# EAGLE design ASP1 K2-234004U (EAGLE 9.6.2)
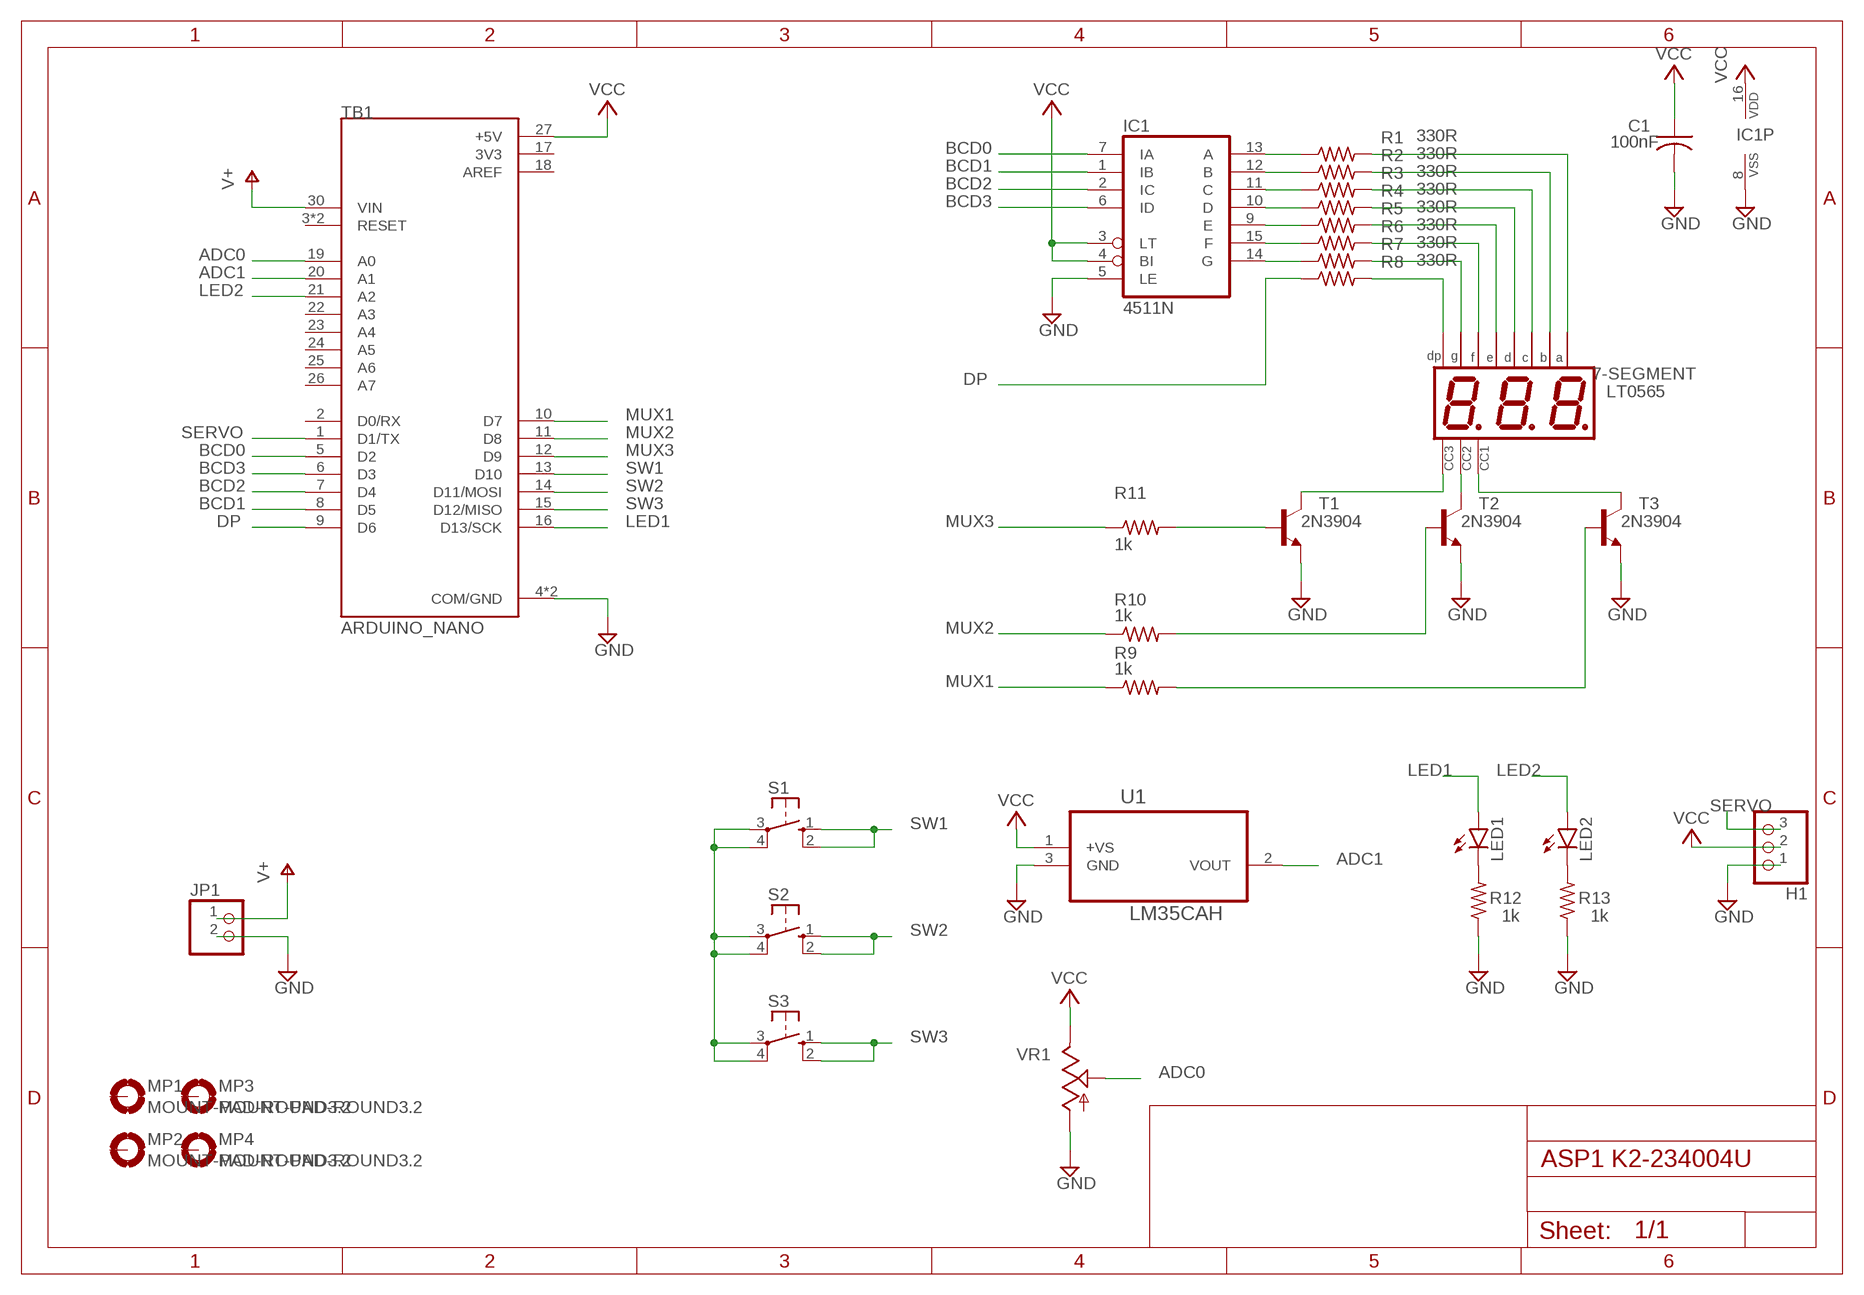
[diagram p0: schematic, sheet 1]

## Parts
7-SEGMENT  LT0565  [BX56/BX55]
C1  100nF  C-US050-024X044  [C050-024X044]
H1  PINHD-1X3  [1X03]
IC1  4511N  [DIL16]
JP1  PINHD-1X2  [1X02]
LED1  LED3MM  [LED3MM]
LED2  LED3MM  [LED3MM]
MP1  MOUNT-PAD-ROUND3.2  [3,2-PAD]
MP2  MOUNT-PAD-ROUND3.2  [3,2-PAD]
MP3  MOUNT-PAD-ROUND3.2  [3,2-PAD]
MP4  MOUNT-PAD-ROUND3.2  [3,2-PAD]
R1  330R  R-US_0207/10  [0207/10]
R2  330R  R-US_0207/10  [0207/10]
R3  330R  R-US_0207/10  [0207/10]
R4  330R  R-US_0207/10  [0207/10]
R5  330R  R-US_0207/10  [0207/10]
R6  330R  R-US_0207/10  [0207/10]
R7  330R  R-US_0207/10  [0207/10]
R8  330R  R-US_0207/10  [0207/10]
R9  1k  R-US_0207/10  [0207/10]
R10  1k  R-US_0207/10  [0207/10]
R11  1k  R-US_0207/10  [0207/10]
R12  1k  R-US_0207/10  [0207/10]
R13  1k  R-US_0207/10  [0207/10]
S1  10-XX  [B3F-10XX]
S2  10-XX  [B3F-10XX]
S3  10-XX  [B3F-10XX]
T1  2N3904  [TO92]
T2  2N3904  [TO92]
T3  2N3904  [TO92]
TB1  ARDUINO_NANO  [SHIELD_ARDUINO_NANO]
U1  LM35CAH  [TO127P543X266-3P]
VR1  POTENTIOMETER_PT10  [PT-10]

## Nets
ADC0 [Signal]: TB1.19(A0) VR1.3(S)
ADC1 [Signal]: TB1.20(A1) U1.2(VOUT)
BCD0 [Signal]: IC1.7(IA) TB1.5(D2)
BCD1 [Signal]: IC1.1(IB) TB1.8(D5)
BCD2 [Signal]: IC1.2(IC) TB1.7(D4)
BCD3 [Signal]: IC1.6(ID) TB1.6(D3)
DP [Signal]: R8.1 TB1.9(D6)
GND [Power]: C1.2 H1.1 IC1.5(LE) IC1.8(VSS) JP1.2 R12.1 R13.1 T1.3(E) T2.3(E) T3.3(E) TB1.4(COM/GND) TB1.29(COM/GND) U1.3(GND) VR1.1(A)
LED1 [Signal]: LED1.A TB1.16(D13/SCK)
LED2 [Signal]: LED2.A TB1.21(A2)
MUX1 [Signal]: R9.1 TB1.10(D7)
MUX2 [Signal]: R10.1 TB1.11(D8)
MUX3 [Signal]: R11.1 TB1.12(D9)
N$1 [Signal]: S1.3(P) S1.4(P1) S2.3(P) S2.4(P1) S3.3(P) S3.4(P1)
N$2 [Signal]: LED2.K(C) R13.2
N$3 [Signal]: LED1.K(C) R12.2
N$4 [Signal]: IC1.13(A) R1.1
N$5 [Signal]: IC1.12(B) R2.1
N$6 [Signal]: IC1.11(C) R3.1
N$7 [Signal]: IC1.10(D) R4.1
N$8 [Signal]: IC1.9(E) R5.1
N$9 [Signal]: IC1.15(F) R6.1
N$10 [Signal]: IC1.14(G) R7.1
N$11 [Signal]: 7-SEGMENT.3(DP) R8.2
N$12 [Signal]: 7-SEGMENT.5(G) R7.2
N$13 [Signal]: 7-SEGMENT.10(F) R6.2
N$14 [Signal]: 7-SEGMENT.1(E) R5.2
N$15 [Signal]: 7-SEGMENT.2(D) R4.2
N$16 [Signal]: 7-SEGMENT.4(C) R3.2
N$17 [Signal]: 7-SEGMENT.11(A) R1.2
N$18 [Signal]: 7-SEGMENT.7(B) R2.2
N$19 [Signal]: 7-SEGMENT.9(CA) T2.1(C)
N$21 [Signal]: 7-SEGMENT.12(CA) T3.1(C)
N$22 [Signal]: 7-SEGMENT.8(CA) T1.1(C)
N$23 [Signal]: R10.2 T2.2(B)
N$24 [Signal]: R9.2 T3.2(B)
N$25 [Signal]: R11.2 T1.2(B)
SERVO [Signal]: H1.3 TB1.1(D1/TX)
SW1 [Signal]: S1.1(S) S1.2(S1) TB1.13(D10)
SW2 [Signal]: S2.1(S) S2.2(S1) TB1.14(D11/MOSI)
SW3 [Signal]: S3.1(S) S3.2(S1) TB1.15(D12/MISO)
V+ [Power]: JP1.1 TB1.30(VIN)
VCC [Power]: C1.1 H1.2 IC1.3(LT) IC1.4(BI) IC1.16(VDD) TB1.27(+5V) U1.1(+VS) VR1.2(E)
Unconnected: MP1.B3,2(MOUNT) MP2.B3,2(MOUNT) MP3.B3,2(MOUNT) MP4.B3,2(MOUNT) TB1.2(D0/RX) TB1.3(RESET) TB1.22(A3) TB1.23(A4) TB1.24(A5) TB1.25(A6) TB1.26(A7) TB1.28(RESET)

## Power pins joined to a net without a drawn wire
3V3: TB1.17(3V3)
AREF: TB1.18(AREF)

## Library data of the parts
7-SEGMENT = MCU Project - Copy:LT0565: 3-Digit Common Cathode LED Numeric Display
C1 = MCU Project - Copy:C-US
H1 = pinhead:PINHD-1X3: PIN HEADER
IC1 = MCU Project - Copy:4511: BCD to 7-segment LATCH/DECODER/DRIVER
JP1 = pinhead:PINHD-1X2: PIN HEADER
LED1 LED2 = MCU Project - Copy:LED3MM
MP1-MP4 = holes:MOUNT-PAD-ROUND: MOUNTING PAD, round
R1-R13 = MCU Project - Copy:R-US
S1-S3 = MCU Project - Copy:10-XX: OMRON SWITCH; MPN: B3F-1000; OC_FARNELL: 176432; OC_NEWARK: 36M3542
T1-T3 = MCU Project - Copy:2N3904: NPN TRANSISTOR
TB1 = MCU Project - Copy:ARDUINO_NANO: Arduino Nano, Through Hole Check availability <https://pricing.snapeda.com/parts/Arduino%20Nano/Arduino/view-part?ref=eda>; AVAILABILITY: Not in stock; CHECK_PRICES: https://www.snapeda.com/parts/Arduino%20Nano/Arduino/view-part/?ref=eda; DESCRIPTION: Small, complete, and breadboard-friendly board based on the ATmega328 (Arduino Nano 3.x); MF: Arduino; MP: Arduino Nano; PACKAGE: Non-Standard Arduino; PRICE: None; SNAPEDA_LINK: https://www.snapeda.com/parts/Arduino%20Nano/Arduino/view-part/?ref=snap
U1 = MCU Project - Copy:LM35CAH: IC, PRECISION TEMP SENSOR Check availability <https://pricing.snapeda.com/parts/LM35CAH/Texas%20Instruments/view-part?ref=eda>; AVAILABILITY: In Stock; CHECK_PRICES: https://www.snapeda.com/parts/LM35CAH/Texas+Instruments/view-part/?ref=eda; DESCRIPTION: 1C high voltage analog temperature sensor, 10 mV/C; MF: Texas Instruments; MP: LM35CAH; PACKAGE: TO-CAN-3 Texas Instruments; PRICE: None; SNAPEDA_LINK: https://www.snapeda.com/parts/LM35CAH/Texas+Instruments/view-part/?ref=snap
VR1 = MCU Project - Copy:POTENTIOMETER

## Net classes
1 Power: width 0.635 mm
2 Signal: width 0.406 mm

## Board
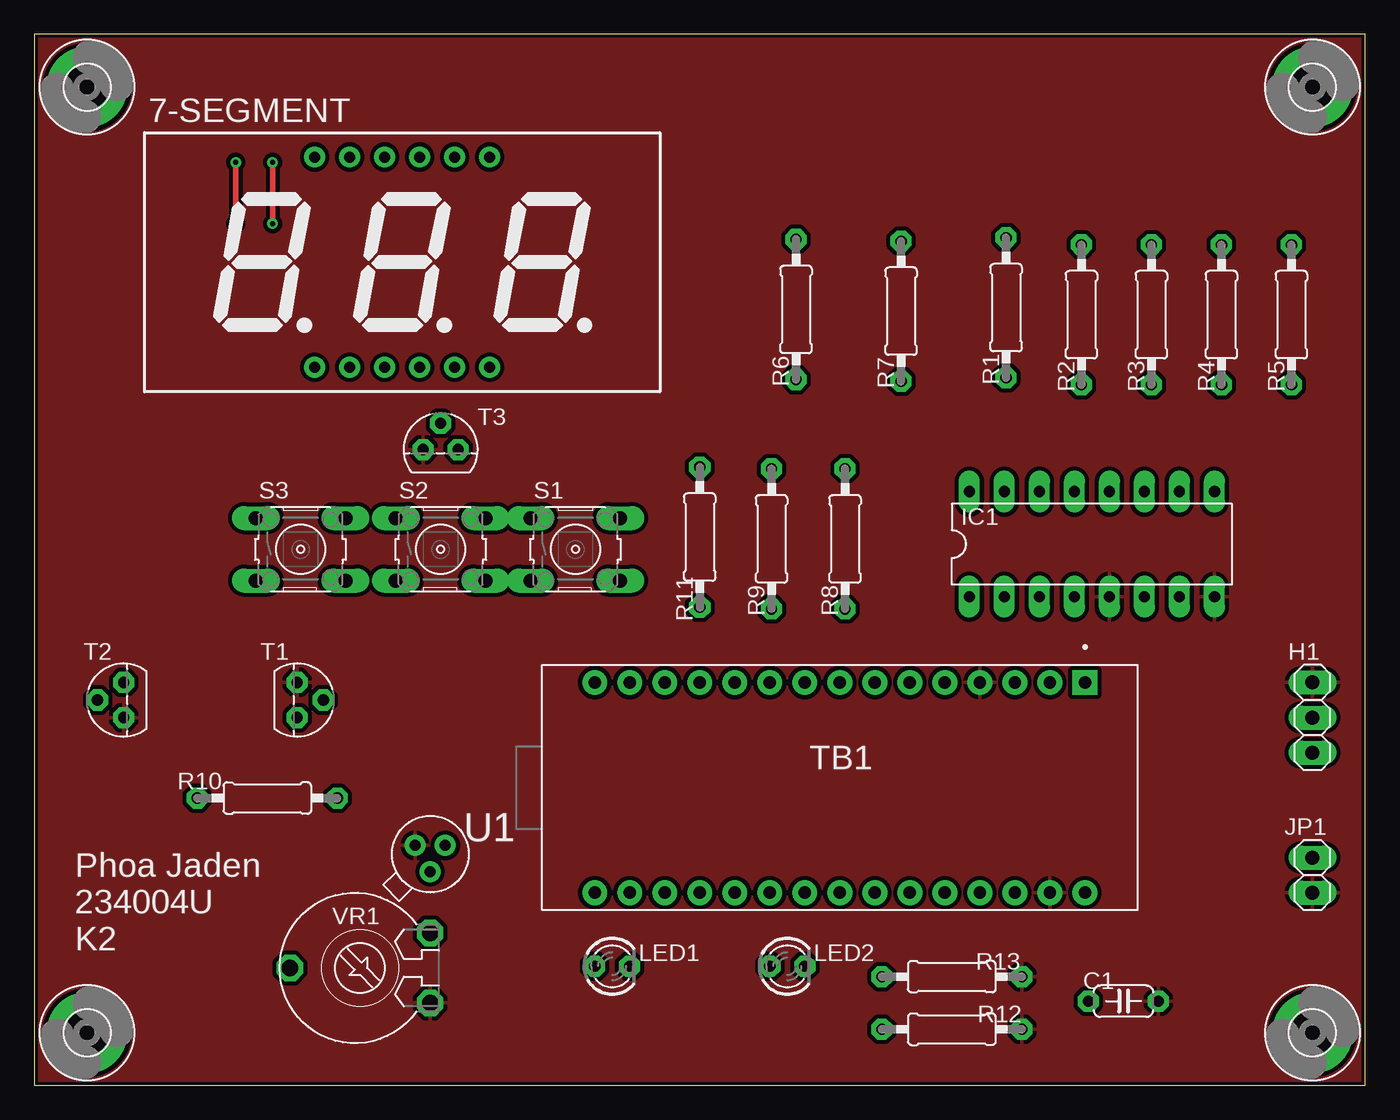
[diagram p1: board, top side]
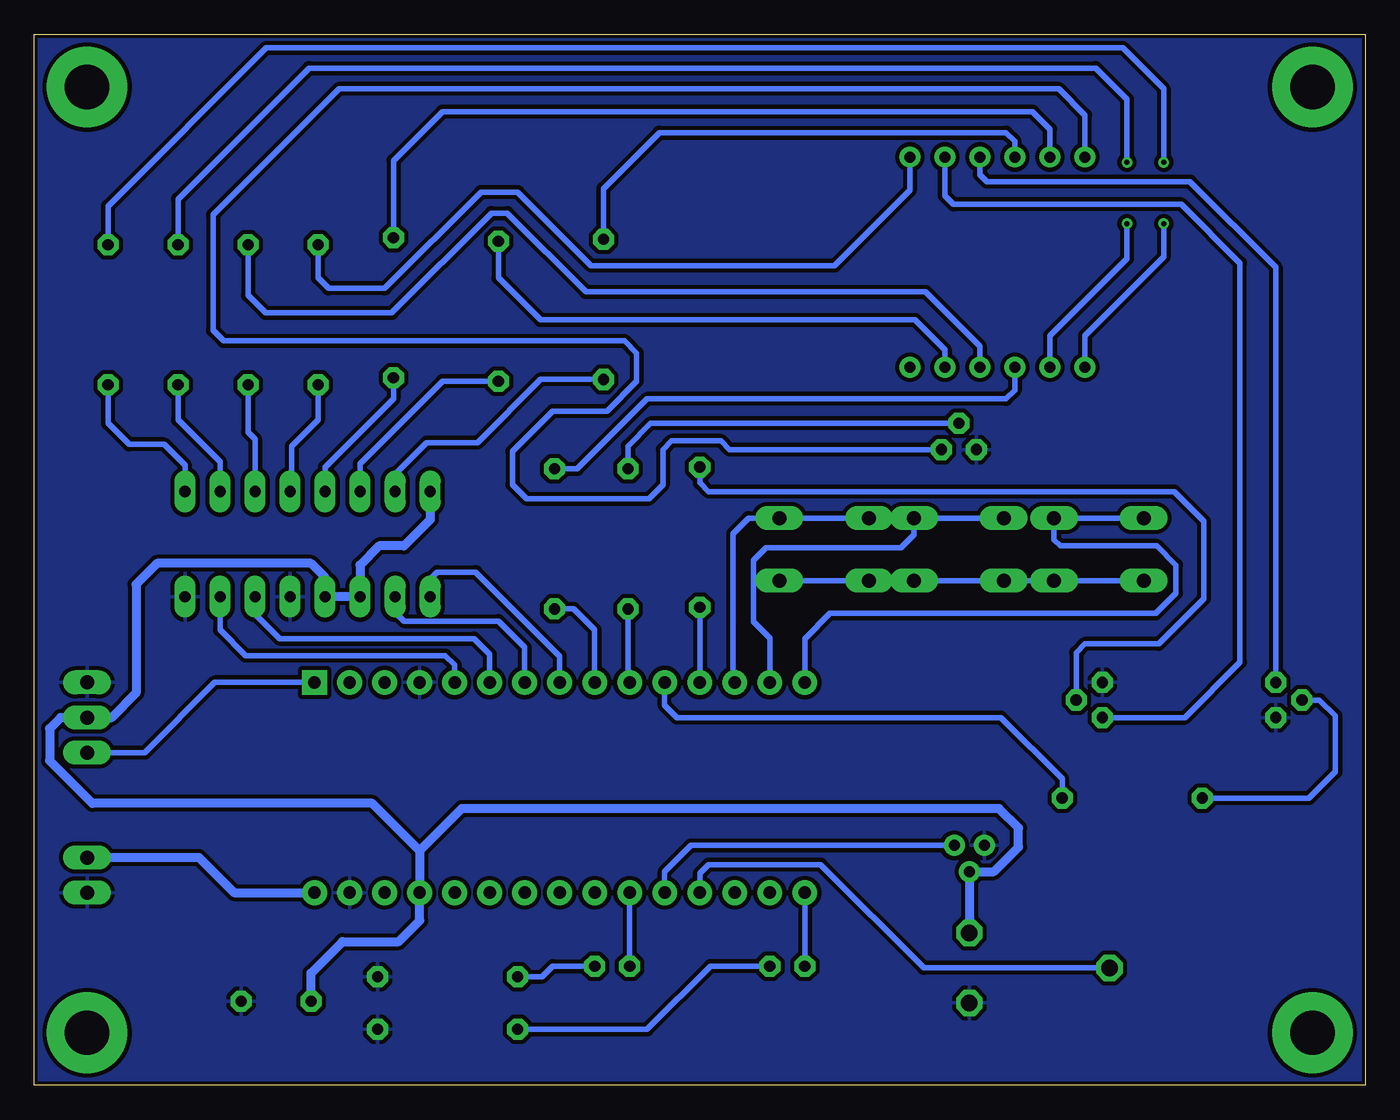
[diagram p2: board, bottom side, seen from below]

Size 96.52 x 76.2 mm. Coordinates in mm from the lower left corner, seen from the top.
Outline: 0,0 96.52,0 96.52,76.2 0,76.2 0,0
Copper layers (1*16): Top 0.035mm / dielectric 1.5mm / Bottom 0.035mm
Design rules "default *": minimum track width 12mil, minimum drill 0.35mm, track to track 12mil, track to pad 12mil, pad to pad 12mil, via to via 12mil, smd to smd 12mil, copper to edge 10mil, drill to drill 6mil, minimum pad ring 14mil, minimum via ring 8mil, stop-mask expansion 4mil, vias tented up to drill 0mil, thermal gap 12mil

### Footprints (pad centres in the part's own frame; a part is rotated, then mirrored left to right if it is on the bottom)
BX56/BX55 = drill 0.8 pad 1.422: 1 -6.35,-7.62; 2 -3.81,-7.62; 3 -1.27,-7.62; 4 1.27,-7.62; 5 3.81,-7.62; 6 6.35,-7.62; 7 6.35,7.62; 8 3.81,7.62; 9 1.27,7.62; 10 -1.27,7.62; 11 -3.81,7.62; 12 -6.35,7.62
C050-024X044 = drill 0.813 octagon: 1 -2.54,0; 2 2.54,0
1X03 = drill 1.016 long: 1 -2.54,0; 2 0,0; 3 2.54,0
DIL16 = drill 0.813 long: 1 -8.89,-3.81; 2 -6.35,-3.81; 3 -3.81,-3.81; 4 -1.27,-3.81; 5 1.27,-3.81; 6 3.81,-3.81; 7 6.35,-3.81; 8 8.89,-3.81; 9 8.89,3.81; 10 6.35,3.81; 11 3.81,3.81; 12 1.27,3.81; 13 -1.27,3.81; 14 -3.81,3.81; 15 -6.35,3.81; 16 -8.89,3.81
1X02 = drill 1.016 long: 1 -1.27,0; 2 1.27,0
LED3MM = drill 0.813 octagon: A -1.27,0; K 1.27,0
3,2-PAD = drill 3.2 pad 5.842: B3,2 0,0
0207/10 = drill 0.813 octagon: 1 -5.08,0; 2 5.08,0
B3F-10XX = drill 1.016 long: 1 -3.251,2.261; 2 3.251,2.261; 3 -3.251,-2.261; 4 3.251,-2.261
TO92 = drill 0.813 octagon: 1 1.27,0; 2 0,1.905; 3 -1.27,0
SHIELD_ARDUINO_NANO = drill 0.9 pad 1.8 square: 1 -7.62,17.78 | drill 0.9 pad 1.8: 2 -7.62,15.24; 3 -7.62,12.7; 4 -7.62,10.16; 5 -7.62,7.62; 6 -7.62,5.08; 7 -7.62,2.54; 8 -7.62,0; 9 -7.62,-2.54; 10 -7.62,-5.08; 11 -7.62,-7.62; 12 -7.62,-10.16; 13 -7.62,-12.7; 14 -7.62,-15.24; 15 -7.62,-17.78; 16 7.62,-17.78; 17 7.62,-15.24; 18 7.62,-12.7; 19 7.62,-10.16; 20 7.62,-7.62; 21 7.62,-5.08; 22 7.62,-2.54; 23 7.62,0; 24 7.62,2.54; 25 7.62,5.08; 26 7.62,7.62; 27 7.62,10.16; 28 7.62,12.7; 29 7.62,15.24; 30 7.62,17.78
TO127P543X266-3P = drill 0.813: 1 0,-2.54; 2 1.092,-0.635; 3 -1.092,-0.635
PT-10 = drill 1.2 pad 1.778 octagon: 1 -2.54,-5.08; 2 2.54,-5.08; 3 0,5.08

### Placement (x,y rotation side)
7-SEGMENT  26.67,59.69 0 top
C1  78.99,6.1 0 top
H1  92.71,26.67 270 top
IC1  76.71,39.24 0 top
JP1  92.71,15.24 270 top
LED1  41.91,8.64 0 top
LED2  54.61,8.64 0 top
MP1  92.71,3.81 0 top
MP2  92.71,72.39 0 top
MP3  3.81,3.81 0 top
MP4  3.81,72.39 0 top
R1  70.48,56.39 90 top
R2  75.95,55.88 90 top
R3  81.03,55.88 90 top
R4  86.11,55.88 90 top
R5  91.19,55.88 90 top
R6  55.24,56.26 90 top
R7  62.87,56.13 90 top
R8  58.8,39.62 90 top
R9  53.47,39.62 90 top
R10  16.89,20.83 180 top
R11  48.26,39.75 90 top
R12  66.55,4.06 180 top
R13  66.55,7.87 180 top
S1  39.24,38.86 0 top
S2  29.46,38.86 0 top
S3  19.3,38.86 0 top
T1  19.05,27.94 270 top
T2  6.48,27.94 90 top
T3  29.46,46.1 0 top
TB1  58.42,21.59 270 top
U1  28.7,18.03 0 top
VR1  23.62,8.51 90 top

### Tracks (layer width: path | path; a pad name or v marks a point on that pad's centre or on a via)
ADC0
  Bottom 0.406: TB1.19 48.26,15.37 47.62,16 39.5,16 32,8.51 VR1.3
ADC1
  Bottom 0.406: TB1.20 50.8,15.49 48.9,17.4 U1.2
BCD0
  Bottom 0.406: TB1.5 66.04,30.48 66.73,31.17 81.2,31.17 83.06,33.02 IC1.7
BCD1
  Bottom 0.406: TB1.8 58.42,31.11 64.52,37.21 67.31,37.21 67.82,36.7 IC1.1
BCD2
  Bottom 0.406: IC1.2 70.36,34.29 69.72,33.66 62.87,33.66 60.96,31.75 TB1.7
BCD3
  Bottom 0.406: IC1.6 80.52,34.16 78.74,32.38 64.64,32.38 63.5,31.24 TB1.6
DP
  Bottom 0.406: R8.1 57.4,34.54 55.88,33.02 TB1.9
GND
  pour Bottom: 0,0 0,76.2 96.52,76.2 96.52,0
  pour Bottom: 0,0 0,76.2 96.52,76.2 96.52,0
  pour Top: 0,0 0,76.2 96.52,76.2 96.52,0
LED1
  Bottom 0.406: TB1.16 LED1.A
LED2
  Bottom 0.406: TB1.21 LED2.A
MUX1
  Bottom 0.406: R9.1 53.47,29.34 TB1.10
MUX2
  Bottom 0.406: TB1.11 50.8,27.56 49.91,26.67 26.42,26.67 21.97,22.23 R10.1
MUX3
  Bottom 0.406: R11.1 TB1.12
N$1
  Bottom 0.406: S3.3 S3.4 S2.3 S2.4 S1.3 S1.4
N$2
  Bottom 0.406: R13.2 59.69,7.87 58.93,8.64 LED2.K
N$3
  Bottom 0.406: R12.2 52.07,4.06 47.5,8.64 LED1.K
N$4
  Bottom 0.406: R1.1 70.48,49.78 75.44,44.83 IC1.13
N$5
  Bottom 0.406: IC1.12 77.85,43.18 77.85,46.35 75.95,48.26 R2.1
N$6
  Bottom 0.406: R3.1 81.03,47.37 80.52,46.86 IC1.11
N$7
  Bottom 0.406: IC1.10 83.06,45.21 86.11,48.26 R4.1
N$8
  Bottom 0.406: IC1.9 85.6,44.96 87.12,46.48 89.66,46.48 91.19,48.01 R5.1
N$9
  Bottom 0.406: IC1.15 70.36,44.32 68.07,46.61 64.39,46.61 59.82,51.18 R6.1
N$10
  Bottom 0.406: R7.1 66.93,51.05 72.9,45.09 IC1.14
N$11
  Bottom 0.406: 7-SEGMENT.3 25.4,50.42 26.04,49.78 52.07,49.78 57.15,44.7 R8.2
N$12
  Bottom 0.406: 7-SEGMENT.5 30.48,53.34 32.64,55.5 59.82,55.5 62.87,58.55 R7.2
N$13
  Bottom 0.406: 7-SEGMENT.10 25.4,68.45 26.04,69.09 51.18,69.09 55.24,65.02 R6.2
N$14  (via drill 0.35)
  Top 0.406: v14.61,66.93 v14.61,62.48
  Bottom 0.406: R5.2 91.19,63.75 79.7,75.23 17.58,75.23 14.61,72.26 v14.61,66.93 | 7-SEGMENT.1 20.32,54.36 14.61,60.07 v14.61,62.48
N$15  (via drill 0.35)
  Top 0.406: v17.27,66.93 v17.27,62.48
  Bottom 0.406: 7-SEGMENT.2 22.86,54.36 17.27,59.94 v17.27,62.48 | R4.2 86.11,64.26 76.61,73.76 19.54,73.76 17.28,71.5 v17.28,66.93 v17.27,66.93
N$16
  Bottom 0.406: R3.2 81.03,57.28 79.76,56.01 70.61,56.01 63.37,63.25 62.23,63.25 56.52,57.53 31.88,57.53 27.94,53.59 7-SEGMENT.4
N$17
  Bottom 0.406: 7-SEGMENT.11 22.86,69.34 24.13,70.61 66.93,70.61 70.48,67.06 R1.2
N$18
  Bottom 0.406: 7-SEGMENT.7 33.02,64.9 38.48,59.44 56.13,59.44 61.47,64.77 64.14,64.77 71.12,57.78 75.18,57.78 75.95,58.55 R2.2
N$19
  Bottom 0.406: 7-SEGMENT.9 27.94,66.04 27.43,65.53 12.7,65.53 6.48,59.31 T2.1
N$21
  Bottom 0.406: 7-SEGMENT.12 20.32,70.36 22.23,72.26 74.42,72.26 83.57,63.12 83.57,54.74 82.8,53.98 53.72,53.98 52.83,53.09 52.83,51.05 54.99,48.9 58.93,48.9 61.85,45.97 61.85,43.56 60.83,42.55 51.94,42.55 50.93,43.56 50.93,46.1 50.29,46.74 46.74,46.74 46.1,46.1 T3.1
N$22
  Bottom 0.406: 7-SEGMENT.8 30.48,64.52 29.84,63.88 14.62,63.88 13.33,63.88 9.07,59.62 9.07,30.68 13.08,26.67 T1.1
N$23
  Bottom 0.406: R10.2 4.06,20.83 2.16,22.73 2.16,26.8 3.3,27.94 T2.2
N$24
  Bottom 0.406: T3.2 51.82,48.01 53.47,46.35 R9.2
N$25
  Bottom 0.406: T1.2 20.95,31.37 20.32,32 14.98,32 11.68,35.3 11.68,40.89 13.84,43.05 47.62,43.05 48.26,43.69 R11.2
SERVO
  Bottom 0.406: H1.3 88.52,24.13 83.44,29.21 TB1.1
SW1
  Bottom 0.406: S1.1 S1.2 44.73,41.12 45.85,40.01 45.85,29.34 TB1.13
SW2
  Bottom 0.406: S2.1 S2.2 32.72,39.93 33.66,38.99 43.44,38.99 44.37,38.06 44.37,33.62 43.18,32.43 TB1.14
SW3
  Bottom 0.406: S3.1 S3.2 22.55,39.57 22.1,39.12 15.11,39.12 13.72,37.72 13.72,35.69 15.19,34.21 38.81,34.21 40.64,32.38 TB1.15
V+
  Bottom 0.635: TB1.30 82.04,13.97 84.58,16.51 JP1.1
VCC
  Bottom 0.635: VR1.2 U1.1 26.92,15.49 25.15,17.27 25.15,18.67 26.54,20.07 65.53,20.07 68.58,17.02 | C1.1 76.45,8.13 74.17,10.41 70.1,10.41 68.58,11.94 TB1.27 68.58,17.02 | 68.58,17.02 72.01,20.45 92.33,20.45 95.43,23.55 95.43,25.86 94.61,26.67 H1.2 90.93,26.67 89.15,28.45 89.15,36.32 87.63,37.85 76.45,37.85 75.44,36.83 IC1.4 IC1.3 72.9,37.72 71.5,39.12 69.72,39.12 67.82,41.02 IC1.16

### Text on the board
tNames: Phoa Jaden / 234004U / K2